# Altium schematic sheet NFC.SchDoc
size A4; SheetNumber: 1; SheetTotal: 1
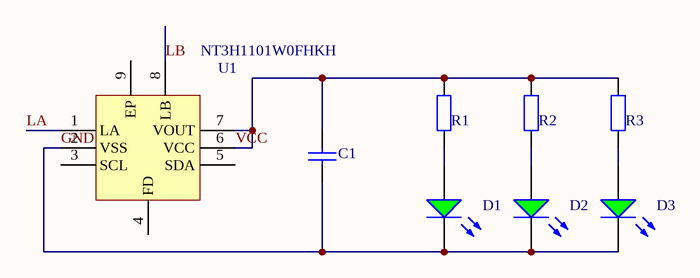
[diagram p0: NFC.SchDoc]

## Parts
C1  220nF (224) 10% 50V  [0805_C]  (value not drawn)
D1  翠绿 0805  [0805_LED_S1]  (value not drawn)
D2  翠绿 0805  [0805_LED_S1]  (value not drawn)
D3  翠绿 0805  [0805_LED_S1]  (value not drawn)
R1  47Ω (47R0) ±1%  [0805_R]  (value not drawn)
R2  47Ω (47R0) ±1%  [0805_R]  (value not drawn)
R3  47Ω (47R0) ±1%  [0805_R]  (value not drawn)
U1  NT3H1101W0FHKH  [XQFN-8_L1.6-W1.6-P0.50-BR]

## Nets
GND: C1.1 D1.K D2.K D3.K U1.2(VSS)
LA: U1.1(LA)
LB: U1.8(LB)
VCC: C1.2 R1.2 R2.1 R3.1 U1.6(VCC) U1.7(VOUT)
NetD1_A: D1.A R1.1
NetD2_A: D2.A R2.2
NetD3_A: D3.A R3.2

Not connected (* = marked no-connect by the designer): U1 3(SCL) 4(FD) 5(SDA) 9(EP)

## Library data of the parts
C1 = 0805 220nF (224) 10% 50V: 贴片电容; ComponentLink1Description: 供应商链接; ComponentLink1URL: http://www.szlcsc.com/product/details_5810.html; Package: 0805; Supplier: LC; SuppliersPartNumber: C5378
D1-D3 = 0805 翠绿: 发光二极管; ComponentLink1Description: 供应商链接; ComponentLink1URL: http://www.szlcsc.com/product/details_2670.html; Package: 0805; Supplier: LC; SuppliersPartNumber: C2297
R1-R3 = 0805 47Ω (47R0) 1%: 贴片电阻; ComponentLink1Description: 供应商链接; ComponentLink1URL: http://www.szlcsc.com/product/details_18402.html; Package: 0805; Supplier: LC; SuppliersPartNumber: C17714
U1 = NT3H1101W0FHKH: NFC芯片